# EAGLE schematic boardv3 (EAGLE 9.1.0)

## Sheet 1 of 2
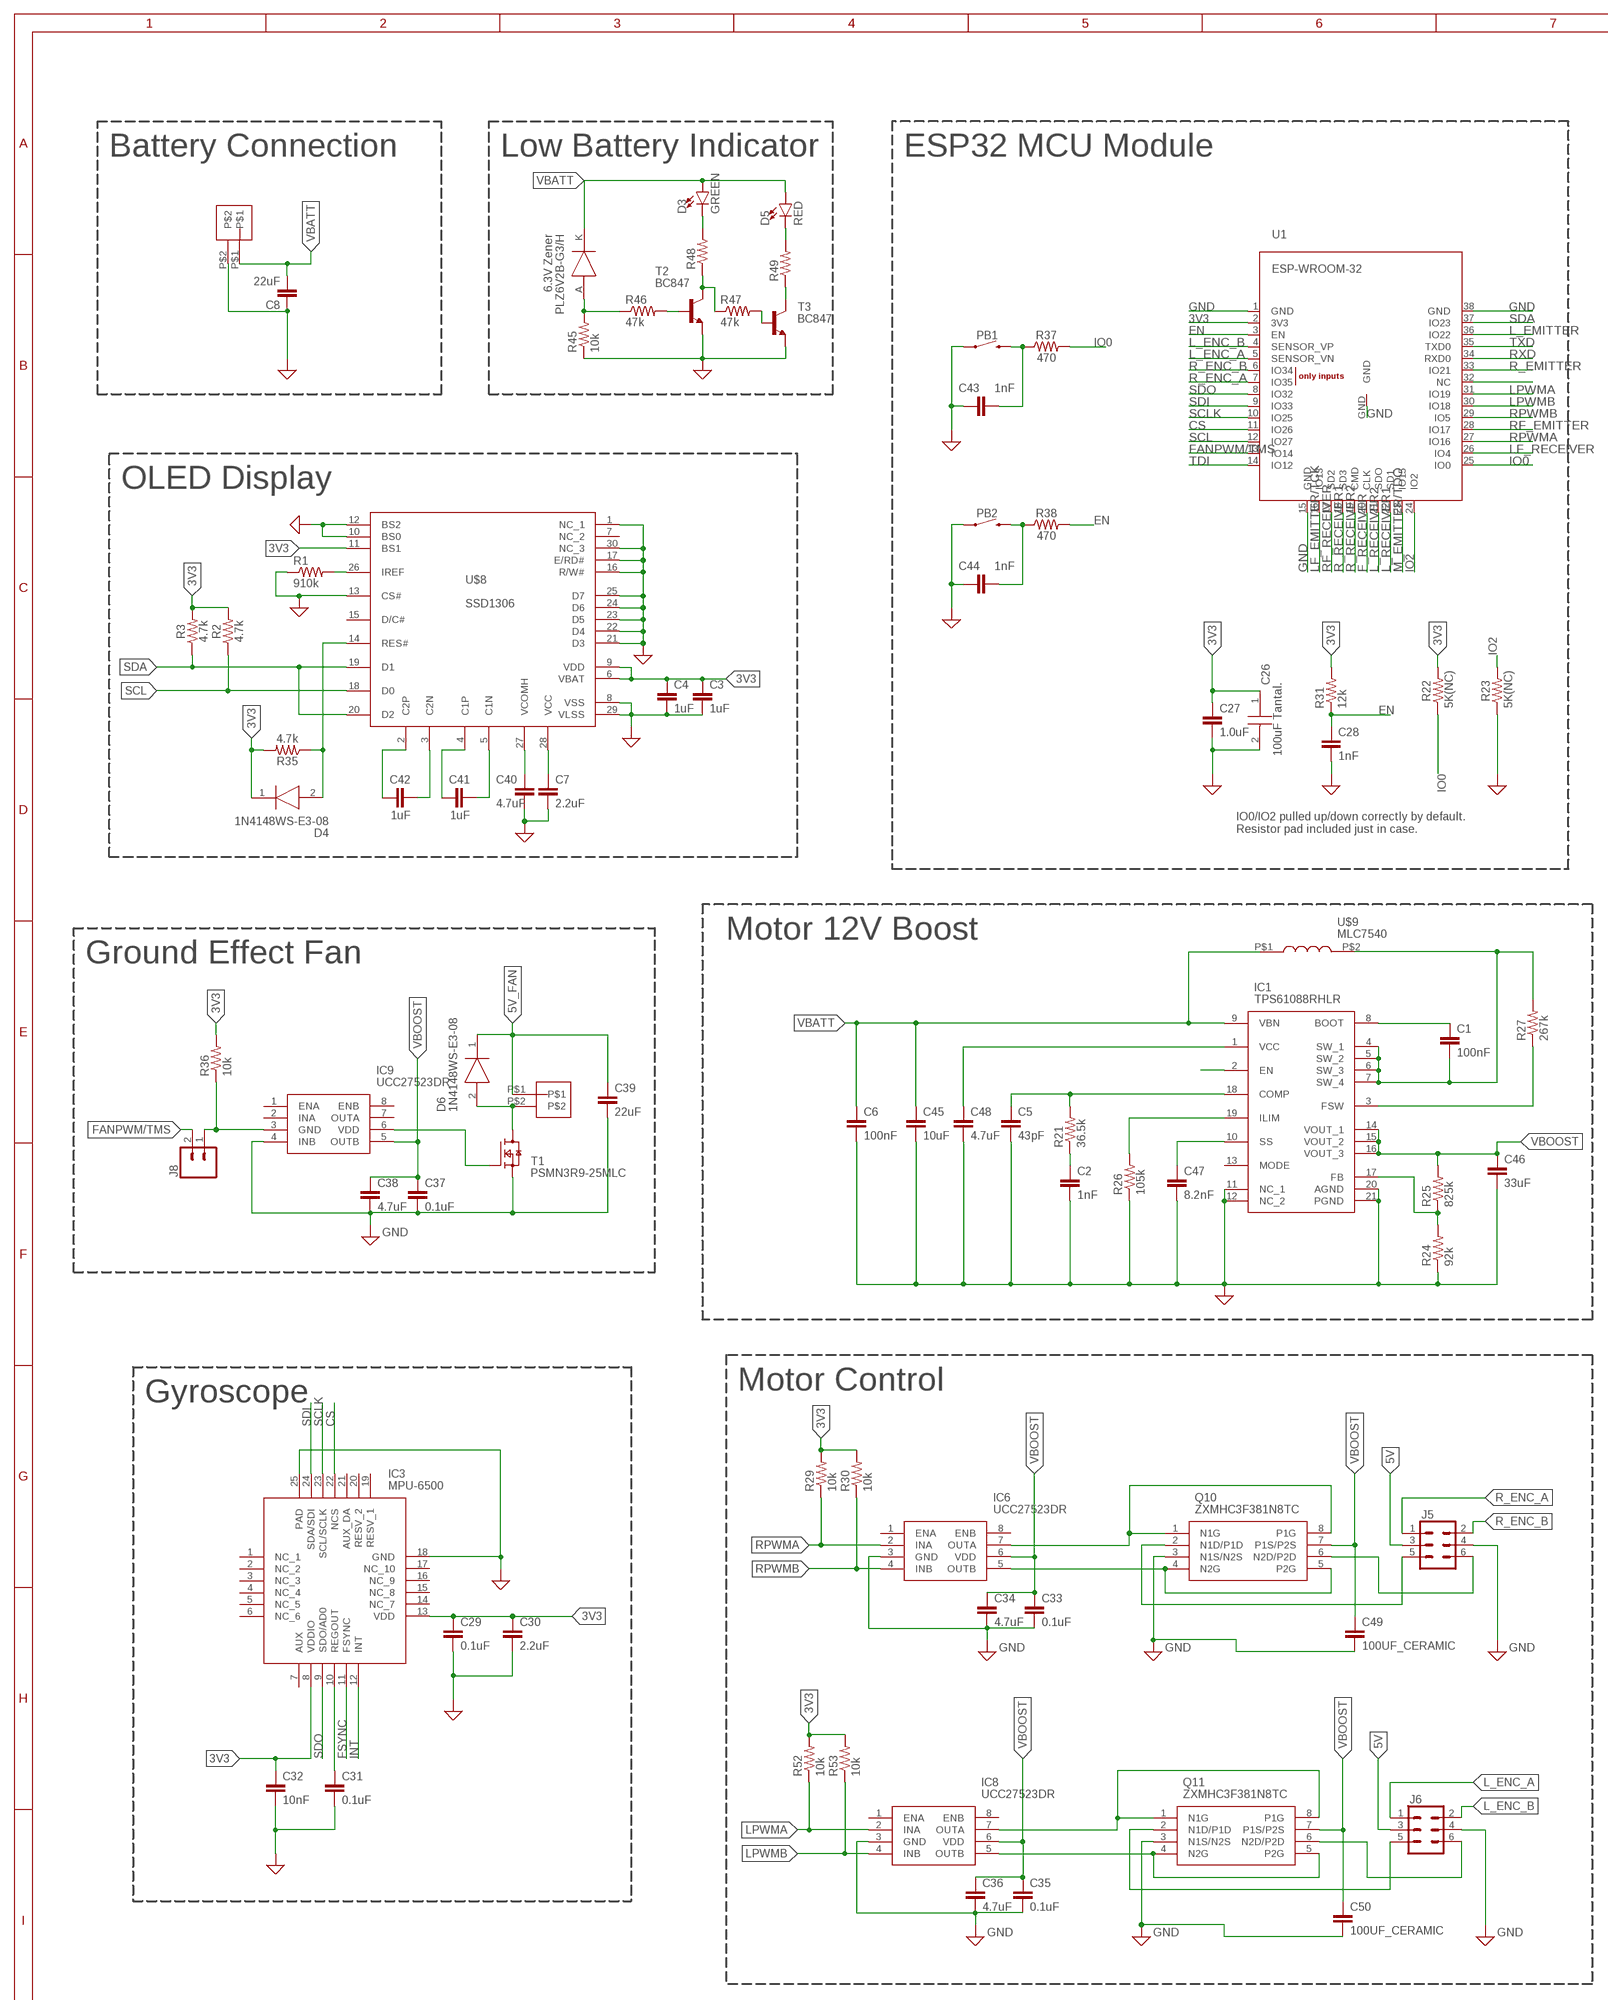
[diagram p0: schematic, sheet 1, part 1 of 2]
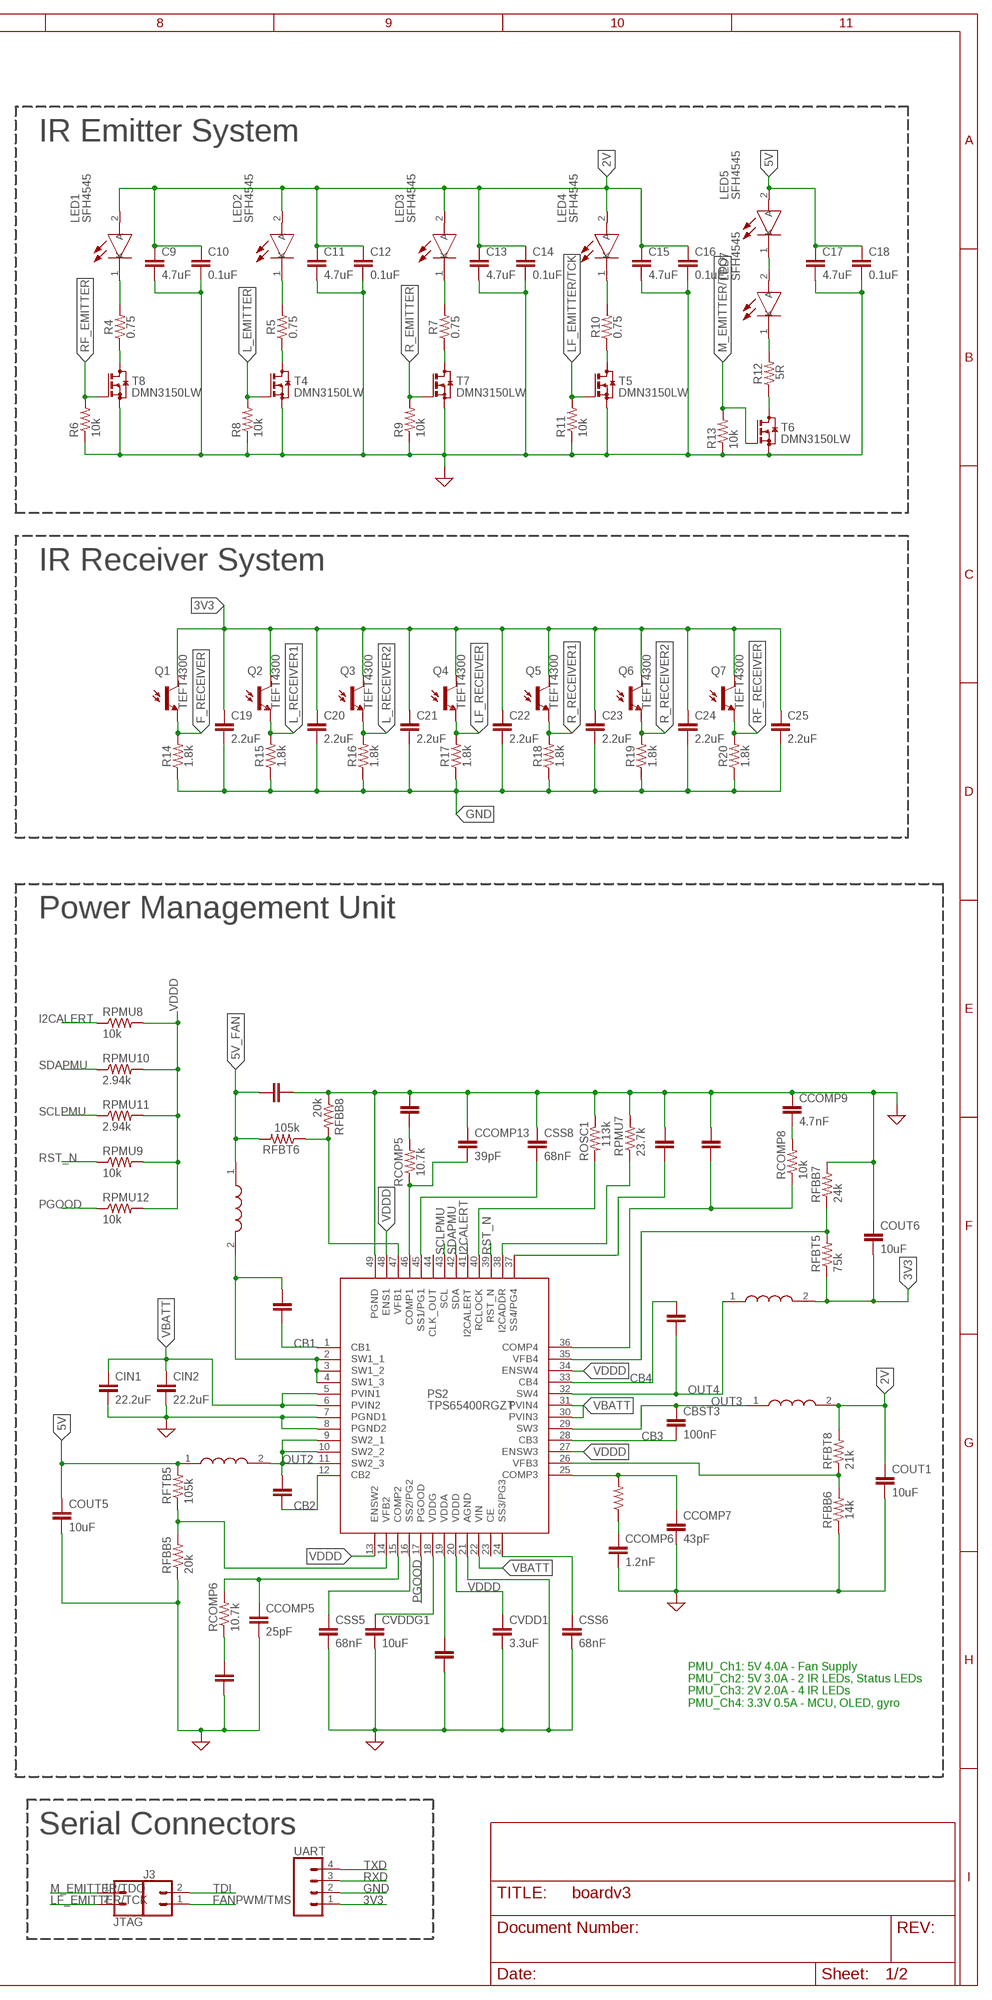
[diagram p1: schematic, sheet 1, part 2 of 2]

### Parts
C1  100nF  C-EUC0402  [C0402]
C2  1nF  C-EUC0805  [C0805]
C3  1uF  C-EUC0402  [C0402]
C4  1uF  C-EUC0402  [C0402]
C5  43pF  C-EUC0402  [C0402]
C6  100nF  C-EUC0805  [C0805]
C7  2.2uF  C-EUC0402  [C0402]
C8  22uF  22UF-0805-6.3V-20%  [0805]
C9  4.7uF  4.7UF0603  [0603]
C10  0.1uF  C-EUC0402  [C0402]
C11  4.7uF  4.7UF0603  [0603]
C12  0.1uF  C-EUC0402  [C0402]
C13  4.7uF  4.7UF0603  [0603]
C14  0.1uF  C-EUC0402  [C0402]
C15  4.7uF  4.7UF0603  [0603]
C16  0.1uF  C-EUC0402  [C0402]
C17  4.7uF  4.7UF0603  [0603]
C18  0.1uF  C-EUC0402  [C0402]
C19  2.2uF  2.2UF-0603-10V-20%  [0603]
C20  2.2uF  2.2UF-0603-10V-20%  [0603]
C21  2.2uF  2.2UF-0603-10V-20%  [0603]
C22  2.2uF  2.2UF-0603-10V-20%  [0603]
C23  2.2uF  2.2UF-0603-10V-20%  [0603]
C24  2.2uF  2.2UF-0603-10V-20%  [0603]
C25  2.2uF  2.2UF-0603-10V-20%  [0603]
C26  100uF Tantal.  TPSB107K006R0400  [CAPPM3528X210N]
C27  1.0uF  1.0UF-0402-16V-10%  [0402]
C28  1nF  1.0NF/1000PF-0603-50V-10%  [0603]
C29  0.1uF  0.1UF-0603-25V-(+80/-20%)  [0603]
C30  2.2uF  2.2UF-0603-10V-20%  [0603]
C31  0.1uF  0.1UF-0603-25V-(+80/-20%)  [0603]
C32  10nF  10NF-0603-50V-10%  [0603]
C33  0.1uF  0.1UF-0603-25V-(+80/-20%)  [0603]
C34  4.7uF  4.7UF0603  [0603]
C35  0.1uF  0.1UF-0603-25V-(+80/-20%)  [0603]
C36  4.7uF  4.7UF0603  [0603]
C37  0.1uF  0.1UF-0603-25V-(+80/-20%)  [0603]
C38  4.7uF  4.7UF0603  [0603]
C39  22uF  22UF-0805-6.3V-20%  [0805]
C40  4.7uF  C-EUC0402  [C0402]
C41  1uF  C-EUC0402  [C0402]
C42  1uF  C-EUC0402  [C0402]
C43  1nF  1.0NF/1000PF-0603-50V-10%  [0603]
C44  1nF  1.0NF/1000PF-0603-50V-10%  [0603]
C45  10uF  C-EUC0402  [C0402]
C46  33uF  C-EUC1206  [C1206]
C47  8.2nF  C-EUC0805  [C0805]
C48  4.7uF  C-EUC0402  [C0402]
C49  100UF_CERAMIC  [C1210]
C50  100UF_CERAMIC  [C1210]
CBST1  100nF  C-EUC0402  [C0402]
CBST2  100nF  C-EUC0402  [C0402]
CBST3  100nF  C-EUC0402  [C0402]
CBST4  100nF  C-EUC0402  [C0402]
CCOMP5  25pF  C-EUC0603  [C0603]
CCOMP6  1.2nF  C-EUC0603  [C0603]
CCOMP7  43pF  C-EUC0603  [C0603]
CCOMP8  1.8nF  C-EUC0603  [C0603]
CCOMP9  4.7nF  C-EUC0603  [C0603]
CCOMP10  82pF  C-EUC0603  [C0603]
CCOMP11  1.2nF  C-EUC0603  [C0603]
CCOMP13  39pF  C-EUC0603  [C0603]
CIN1  22.2uF  10UF-0805-10V-10%  [0805]
CIN2  22.2uF  10UF-0805-10V-10%  [0805]
CIN3  22.2uF  10UF-0805-10V-10%  [0805]
COUT1  10uF  C-EUC0402  [C0402]
COUT5  10uF  C-EUC0402  [C0402]
COUT6  10uF  C-EUC0402  [C0402]
CSS5  68nF  C-EUC0402  [C0402]
CSS6  68nF  C-EUC0402  [C0402]
CSS7  68nF  C-EUC0402  [C0402]
CSS8  68nF  C-EUC0402  [C0402]
CVDD1  3.3uF  C-EUC0402  [C0402]
CVDDA1  4.7uF  4.7UF0603  [0603]
CVDDG1  10uF  C-EUC0603  [C0603]
D3  GREEN  LED-GREEN0603  [LED-0603]
D4  1N4148WS-E3-08  [SOD2713X115N]
D5  RED  LED-RED0603  [LED-0603]
D6  1N4148WS-E3-08  [SOD2713X115N]
IC1  TPS61088RHLR  [RHL(R-PVQFN-N20)_1]
IC3  MPU-6500  [QFN40P300X300X95-25N]
IC6  UCC27523DR  [SOIC127P600X175-8N]
IC8  UCC27523DR  [SOIC127P600X175-8N]
IC9  UCC27523DR  [SOIC127P600X175-8N]
J2  2_PIN_JST-XH  [2_PIN_JST-XH]
J3  CONN_02  [1X02]
J5  CONN_03X22X3_SILK_MALE_PTH  [2X3]
J6  CONN_03X22X3_SILK_MALE_PTH  [2X3]
J7  2_PIN_JST-XH  [2_PIN_JST-XH]
J8  CONN_02  [1X02]
JTAG  CONN_02  [1X02]
L5  XAL4030-332MEB  [XAL4030-332MEB]
L6  SDR0302-100ML  SDR0302-1R2ML  [SDR0302-471KL]
L7  XAL4030-472MEB  XAL4030-332MEB  [XAL4030-332MEB]
L8  XFL4020-472MEB  XFL4020-332MEB  [XFL4020-222ME]
LED1  SFH4545  SFH4550  [SFH_4556P]
LED2  SFH4545  SFH4550  [SFH_4556P]
LED3  SFH4545  SFH4550  [SFH_4556P]
LED4  SFH4545  SFH4550  [SFH_4556P]
LED5  SFH4545  SFH4550  [SFH_4556P]
LED7  SFH4545  SFH4550  [SFH_4556P]
PB1  SPST_3X6X2.5MMPB  [3X6X2.5MMSPB]
PB2  SPST_3X6X2.5MMPB  [3X6X2.5MMSPB]
PLZ6V2B-G3/H  6.3V Zener  PLZ6V8C-HG3/H  [DO-219AC]
PS2  TPS65400RGZT  [QFN50P700X700X100-49N]
Q1  TEFT4300  [TEFT4300]
Q2  TEFT4300  [TEFT4300]
Q3  TEFT4300  [TEFT4300]
Q4  TEFT4300  [TEFT4300]
Q5  TEFT4300  [TEFT4300]
Q6  TEFT4300  [TEFT4300]
Q7  TEFT4300  [TEFT4300]
Q10  ZXMHC3F381N8TC  [SOIC127P600X175-8N]
Q11  ZXMHC3F381N8TC  [SOIC127P600X175-8N]
R1  910k  R-US_R0402  [R0402]
R2  4.7k  4.7KOHM-0603-1/10W-1%  [0603]
R3  4.7k  4.7KOHM-0603-1/10W-1%  [0603]
R4  0.75  0.75OHM-0805-1/4W-1%  [0805]
R5  0.75  0.75OHM-0805-1/4W-1%  [0805]
R6  10k  R-US_R0201  [R0201]
R7  0.75  0.75OHM-0805-1/4W-1%  [0805]
R8  10k  R-US_R0201  [R0201]
R9  10k  R-US_R0201  [R0201]
R10  0.75  0.75OHM-0805-1/4W-1%  [0805]
R11  10k  R-US_R0201  [R0201]
R12  5R  RESISTOR0805  [0805]
R13  10k  R-US_R0201  [R0201]
R14  1.8k  1.8KOHM-0603-1/10W-1%  [0603]
R15  1.8k  1.8KOHM-0603-1/10W-1%  [0603]
R16  1.8k  1.8KOHM-0603-1/10W-1%  [0603]
R17  1.8k  1.8KOHM-0603-1/10W-1%  [0603]
R18  1.8k  1.8KOHM-0603-1/10W-1%  [0603]
R19  1.8k  1.8KOHM-0603-1/10W-1%  [0603]
R20  1.8k  1.8KOHM-0603-1/10W-1%  [0603]
R21  36.5k  R-US_R0201  [R0201]
R22  5K(NC)  RESISTOR0402  [0402]
R23  5K(NC)  RESISTOR0402  [0402]
R24  92k  R-US_R0805  [R0805]
R25  825k  R-US_R0402  [R0402]
R26  105k  R-US_R0201  [R0201]
R27  267k  R-US_R0402  [R0402]
R29  10k  R-US_R0201  [R0201]
R30  10k  R-US_R0201  [R0201]
R31  12k  R-US_R0201  [R0201]
R35  4.7k  4.7KOHM-0603-1/10W-1%  [0603]
R36  10k  R-US_R0201  [R0201]
R37  470  470OHM-0603-1/10W-1%  [0603]
R38  470  470OHM-0603-1/10W-1%  [0603]
R45  10k  R-US_R0402  [R0402]
R46  47k  R-US_R0402  [R0402]
R47  47k  R-US_R0402  [R0402]
R48  R-US_R0603  [R0603]
R49  R-US_R0603  [R0603]
R52  10k  R-US_R0201  [R0201]
R53  10k  R-US_R0201  [R0201]
RCOMP5  10.7k  RESISTOR0402  [0402]
RCOMP6  10.7k  R-US_R0402  [R0402]
RCOMP7  9.31k  R-US_R0402  [R0402]
RCOMP8  10k  R-US_R0201  [R0201]
RFBB5  20k  R-US_R0805  [R0805]
RFBB6  14k  RESISTOR0402  [0402]
RFBB7  24k  R-US_R0805  [R0805]
RFBB8  20k  R-US_R0805  [R0805]
RFBT5  75k  R-US_R0402  [R0402]
RFBT6  105k  R-US_R0201  [R0201]
RFBT8  21k  R-US_R0402  [R0402]
RFTB5  105k  R-US_R0201  [R0201]
ROSC1  113k  R-US_R0402  [R0402]
RPMU7  23.7k  R-US_R0201  [R0201]
RPMU8  10k  R-US_R0201  [R0201]
RPMU9  10k  R-US_R0201  [R0201]
RPMU10  2.94k  R-US_R0402  [R0402]
RPMU11  2.94k  R-US_R0402  [R0402]
RPMU12  10k  R-US_R0201  [R0201]
T1  PSMN3R9-25MLC  [SOT1210]
T2  BC847  [SOT23]
T3  BC847  [SOT23]
T4  DMN3150LW  [SOT323]
T5  DMN3150LW  [SOT323]
T6  DMN3150LW  [SOT323]
T7  DMN3150LW  [SOT323]
T8  DMN3150LW  [SOT323]
U1  ESP-WROOM-32  [ESP-WROOM-32]
U$8  SSD1306  [30PINFPC_P0.7MM]
U$9  MLC7540  [MLC7540]
UART  CONN_04  [1X04]

### Nets
2V: C9.1 C10.1 C11.1 C12.1 C13.1 C14.1 C15.1 C16.1 COUT1.1 L8.2 LED1.2(A) LED2.2(A) LED3.2(A) LED4.2(A) RFBT8.2
3V3: C3.1 C4.1 C19.1 C20.1 C21.1 C22.1 C23.1 C24.1 C25.1 C26.1 C27.1 C29.1 C30.1 C32.1 COUT6.2 D4.1(K) IC3.8(VDDIO) IC3.13(VDD) L6.2 Q1.1(C) Q2.1(C) Q3.1(C) Q4.1(C) Q5.1(C) Q6.1(C) Q7.1(C) R2.2 R3.2 R22.2 R29.2 R30.2 R31.2 R35.2 R36.2 R52.2 R53.2 RFBT5.1 U1.2(3V3) U$8.6(VBAT) U$8.9(VDD) U$8.11(BS1) UART.1
5V: C17.1 C18.1 COUT5.1 J5.3 J6.3 L5.1 LED5.2(A) RFTB5.2
5V_FAN: C39.1 CIN3.1 D6.1(K) J7.P$1 L7.1 RFBT6.2
BOOSTEN: IC1.2(EN)
CB1: CBST1.1 PS2.1(CB1)
CB2: CBST2.1 PS2.12(CB2)
CB3: CBST3.2 PS2.28(CB3)
CB4: CBST4.2 PS2.33(CB4)
COMP1: CCOMP13.2 PS2.46(COMP1) RCOMP5.1
COMP2: CCOMP5.1 PS2.15(COMP2) RCOMP6.2
COMP3: CCOMP7.1 PS2.25(COMP3) RCOMP7.2
COMP4: CCOMP10.1 PS2.36(COMP4) RCOMP8.1
CS: IC3.22(NCS) U1.11(IO26)
EN: C28.1 R31.1 R38.2 U1.3(EN)
F_RECEIVER: Q1.2(E) R14.2 U1.20(CLK)
FANPWM: IC9.3(GND) J8.1 R36.1
FANPWM/TMS: J3.1 J8.2 U1.13(IO14)
FSYNC: IC3.11(FSYNC)
GND: C2.2 C3.2 C4.2 C5.2 C6.2 C7.2 C8.1 C9.2 C10.2 C11.2 C12.2 C13.2 C14.2 C15.2 C16.2 C17.2 C18.2 C19.2 C20.2 C21.2 C22.2 C23.2 C24.2 C25.2 C26.2 C27.2 C28.2 C29.2 C30.2 C31.2 C32.2 C33.2 C34.2 C35.2 C36.2 C37.2 C38.2 C39.2 C40.2 C43.1 C44.1 C45.2 C46.2 C47.2 C48.2 C49.2 C50.2 CCOMP5.2 CCOMP6.2 CCOMP7.2 CCOMP8.1 CCOMP9.1 CCOMP10.2 CCOMP11.1 CCOMP13.1 CIN1.2 CIN2.2 CIN3.2 COUT1.2 COUT5.2 COUT6.1 CSS5.2 CSS6.2 CSS7.2 CSS8.1 CVDD1.2 CVDDA1.1 CVDDG1.2 IC1.11(NC_1) IC1.12(NC_2) IC1.20(AGND) IC1.21(PGND) IC3.18(GND) IC3.25(PAD) IC6.3(GND) IC8.3(GND) IC9.4(INB) J2.P$2 J5.4 J6.4 PB1.1 PB2.1 PS2.7(PGND1) PS2.8(PGND2) PS2.21(AGND) PS2.49(PGND) Q10.3(N1S/N2S) Q11.3(N1S/N2S) R1.1 R6.1 R8.1 R9.1 R11.1 R13.1 R14.1 R15.1 R16.1 R17.1 R18.1 R19.1 R20.1 R23.1 R24.1 R26.1 R45.1 RFBB5.1 RFBB6.1 RFBB7.2 RFBB8.1 ROSC1.1 RPMU7.2 T1.1(S) T1.2(S) T1.3(S) T2.2(E) T3.2(E) T4.S T5.S T6.S T7.S T8.S U1.1(GND) U1.15(GND) U1.38(GND) U1.GND U$8.1(NC_1) U$8.8(VSS) U$8.10(BS0) U$8.12(BS2) U$8.13(CS#) U$8.16(R/W#) U$8.17(E/RD#) U$8.21(D3) U$8.22(D4) U$8.23(D5) U$8.24(D6) U$8.25(D7) U$8.29(VLSS) U$8.30(NC_3) UART.2 ; supply symbol labelled SUP
I2CADDR: PS2.38(I2CADDR) RPMU7.1
I2CALERT: PS2.41(I2CALERT) RPMU8.1
INT: IC3.12(INT)
IO0: R22.1 R37.2 U1.25(IO0)
IO2: R23.2 U1.24(IO2)
L_EMITTER: R8.2 T4.G U1.36(IO22)
L_ENC_A: J6.1 U1.5(SENSOR_VN)
L_ENC_B: J6.2 U1.4(SENSOR_VP)
L_RECEIVER1: Q2.2(E) R15.2 U1.22(SD1)
L_RECEIVER2: Q3.2(E) R16.2 U1.21(SDO)
LF_EMITTER/TCK: JTAG.2 R11.2 T5.G U1.16(IO13)
LF_RECEIVER: Q4.2(E) R17.2 U1.26(IO4)
LPWMA: IC8.2(INA) R52.1 U1.31(IO19)
LPWMB: IC8.4(INB) R53.1 U1.30(IO18)
M_EMITTER/TDO: JTAG.1 R13.2 T6.G U1.23(IO15)
N1D: J5.5 Q10.2(N1D/P1D)
N1D_2: J6.5 Q11.2(N1D/P1D)
N1G: IC6.7(OUTA) Q10.1(N1G) Q10.8(P1G)
N1G_2: IC8.7(OUTA) Q11.1(N1G) Q11.8(P1G)
N2D: J5.6 Q10.6(N2D/P2D)
N2D_2: J6.6 Q11.6(N2D/P2D)
N2G: IC6.5(OUTB) Q10.4(N2G) Q10.5(P2G)
N2G_2: IC8.5(OUTB) Q11.4(N2G) Q11.5(P2G)
N$1: C5.1 IC1.18(COMP) R21.2
N$2: C1.1 IC1.8(BOOT)
N$3: C1.2 IC1.4(SW_1) IC1.5(SW_2) IC1.6(SW_3) IC1.7(SW_4) R27.2 U$9.P$2
N$4: C48.1 IC1.1(VCC)
N$6: C47.1 IC1.10(SS)
N$12: R46.2 T2.1(B)
N$13: LED5.1(K) LED7.2(A)
N$14: IC1.19(ILIM) R26.2
N$15: C2.1 R21.1
N$16: LED1.1(K) R4.2
N$17: R4.1 T8.D
N$20: LED7.1(K) R12.2
N$21: LED2.1(K) R5.2
N$22: R5.1 T4.D
N$23: R12.1 T6.D
N$24: C43.2 PB1.2 R37.1
N$26: LED3.1(K) R7.2
N$27: R7.1 T7.D
N$28: IC9.6(VDD) T1.4(G)
N$29: IC1.17(FB) R24.2 R25.1
N$30: D6.2(A) J7.P$2 T1.MB(D)
N$31: LED4.1(K) R10.2
N$32: R10.1 T5.D
N$34: IC1.3(FSW) R27.1
N$37: C44.2 PB2.2 R38.1
N$45: PLZ6V2B-G3/H.A R45.2 R46.1
N$46: R47.1 R48.1 T2.3(C)
N$47: R47.2 T3.1(B)
N$48: D3.C R48.2
N$49: C42.1 U$8.2(C2P)
N$50: D5.C R49.2
N$51: R49.1 T3.3(C)
N$56: C42.2 U$8.3(C2N)
N$57: C41.1 U$8.4(C1P)
N$58: C41.2 U$8.5(C1N)
N$59: C40.1 U$8.27(VCOMH)
N$60: C7.1 U$8.28(VCC)
N$61: D4.2(A) R35.1 U$8.14(RES#)
N$63: R1.2 U$8.26(IREF)
N$68: CCOMP6.1 RCOMP7.1
N$74: CCOMP8.2 RCOMP6.1
N$80: CCOMP9.2 RCOMP8.2
N$85: CCOMP11.2 RCOMP5.2
NC: U1.32(NC)
OUT1: CBST1.2 L7.2 PS2.2(SW1_1) PS2.3(SW1_2) PS2.4(SW1_3)
OUT2: CBST2.2 L5.2 PS2.9(SW2_1) PS2.10(SW2_2) PS2.11(SW2_3)
OUT3: CBST3.1 L8.1 PS2.29(SW3)
OUT4: CBST4.1 L6.1 PS2.32(SW4)
PGOOD: PS2.17(PGOOD) RPMU12.1
R_EMITTER: R9.2 T7.G U1.33(IO21)
R_ENC_A: J5.1 U1.7(IO35)
R_ENC_B: J5.2 U1.6(IO34)
R_RECEIVER1: Q5.2(E) R18.2 U1.18(SD3)
R_RECEIVER2: Q6.2(E) R19.2 U1.19(CMD)
RCLOCK: PS2.40(RCLOCK) ROSC1.2
REGOUT: C31.1 IC3.10(REGOUT)
RF_EMITTER: R6.2 T8.G U1.28(IO17)
RF_RECEIVER: Q7.2(E) R20.2 U1.17(SD2)
RPWMA: IC6.2(INA) R29.1 U1.27(IO16)
RPWMB: IC6.4(INB) R30.1 U1.29(IO5)
RST_N: PS2.39(RST_N) RPMU9.1
RXD: U1.34(RXD0) UART.3
SCL: R2.1 U1.12(IO27) U$8.18(D0)
SCLK: IC3.23(SCL/SCLK) U1.10(IO25)
SCLPMU: PS2.43(SCL) RPMU11.1
SDA: R3.1 U1.37(IO23) U$8.19(D1) U$8.20(D2)
SDAPMU: PS2.42(SDA) RPMU10.1
SDI: IC3.24(SDA/SDI) U1.9(IO33)
SDO: IC3.9(SDO/AD0) U1.8(IO32)
SS1: CSS8.2 PS2.45(SS1/PG1)
SS2: CSS5.1 PS2.16(SS2/PG2)
SS3: CSS6.1 PS2.24(SS3/PG3)
SS4: CSS7.1 PS2.37(SS4/PG4)
TDI: J3.2 U1.14(IO12)
TXD: U1.35(TXD0) UART.4
VBATT: C6.1 C8.2 C45.1 CIN1.1 CIN2.1 D3.A D5.A IC1.9(VBN) J2.P$1 PLZ6V2B-G3/H.K PS2.5(PVIN1) PS2.6(PVIN2) PS2.22(VIN) PS2.30(PVIN3) PS2.31(PVIN4) U$9.P$1
VBOOST: C33.1 C34.1 C35.1 C36.1 C37.1 C38.1 C46.1 C49.1 C50.1 IC1.14(VOUT_1) IC1.15(VOUT_2) IC1.16(VOUT_3) IC6.6(VDD) IC8.6(VDD) IC9.5(OUTB) Q10.7(P1S/P2S) Q11.7(P1S/P2S) R25.2
VDDA: CVDDA1.2 PS2.19(VDDA)
VDDD: CVDD1.1 PS2.13(ENSW2) PS2.20(VDDD) PS2.27(ENSW3) PS2.34(ENSW4) PS2.48(ENS1) RPMU8.2 RPMU9.2 RPMU10.2 RPMU11.2 RPMU12.2
VDDG: CVDDG1.1 PS2.18(VDDG)
VFB1: PS2.47(VFB1) RFBB8.2 RFBT6.1
VFB2: PS2.14(VFB2) RFBB5.2 RFTB5.1
VFB3: PS2.26(VFB3) RFBB6.2 RFBT8.1
VFB4: PS2.35(VFB4) RFBB7.1 RFBT5.2
Unconnected: IC1.13(MODE) IC3.1(NC_1) IC3.2(NC_2) IC3.3(NC_3) IC3.4(NC_4) IC3.5(NC_5) IC3.6(NC_6) IC3.7(AUX) IC3.14(NC_7) IC3.15(NC_8) IC3.16(NC_9) IC3.17(NC_10) IC3.19(RESV_1) IC3.20(RESV_2) IC3.21(AUX_DA) IC6.1(ENA) IC6.8(ENB) IC8.1(ENA) IC8.8(ENB) IC9.1(ENA) IC9.2(INA) IC9.7(OUTA) IC9.8(ENB) PS2.23(CE) PS2.44(CLK_OUT) U$8.7(NC_2) U$8.15(D/C#)

### Notes on the sheet
- IR Emitter System
- Battery Connection | Low Battery Indicator | ESP32 MCU Module
- OLED Display
- IR Receiver System
- IO0/IO2 pulled up/down correctly by default. 
  Resistor pad included just in case.
- Motor 12V Boost | Power Management Unit
- Ground Effect Fan
- Motor Control
- Gyroscope
- PMU_Ch1: 5V 4.0A - Fan Supply
  PMU_Ch2: 5V 3.0A - 2 IR LEDs, Status LEDs
  PMU_Ch3: 2V 2.0A - 4 IR LEDs
  PMU_Ch4: 3.3V 0.5A - MCU, OLED, gyro
- Serial Connectors

## Sheet 2 of 2
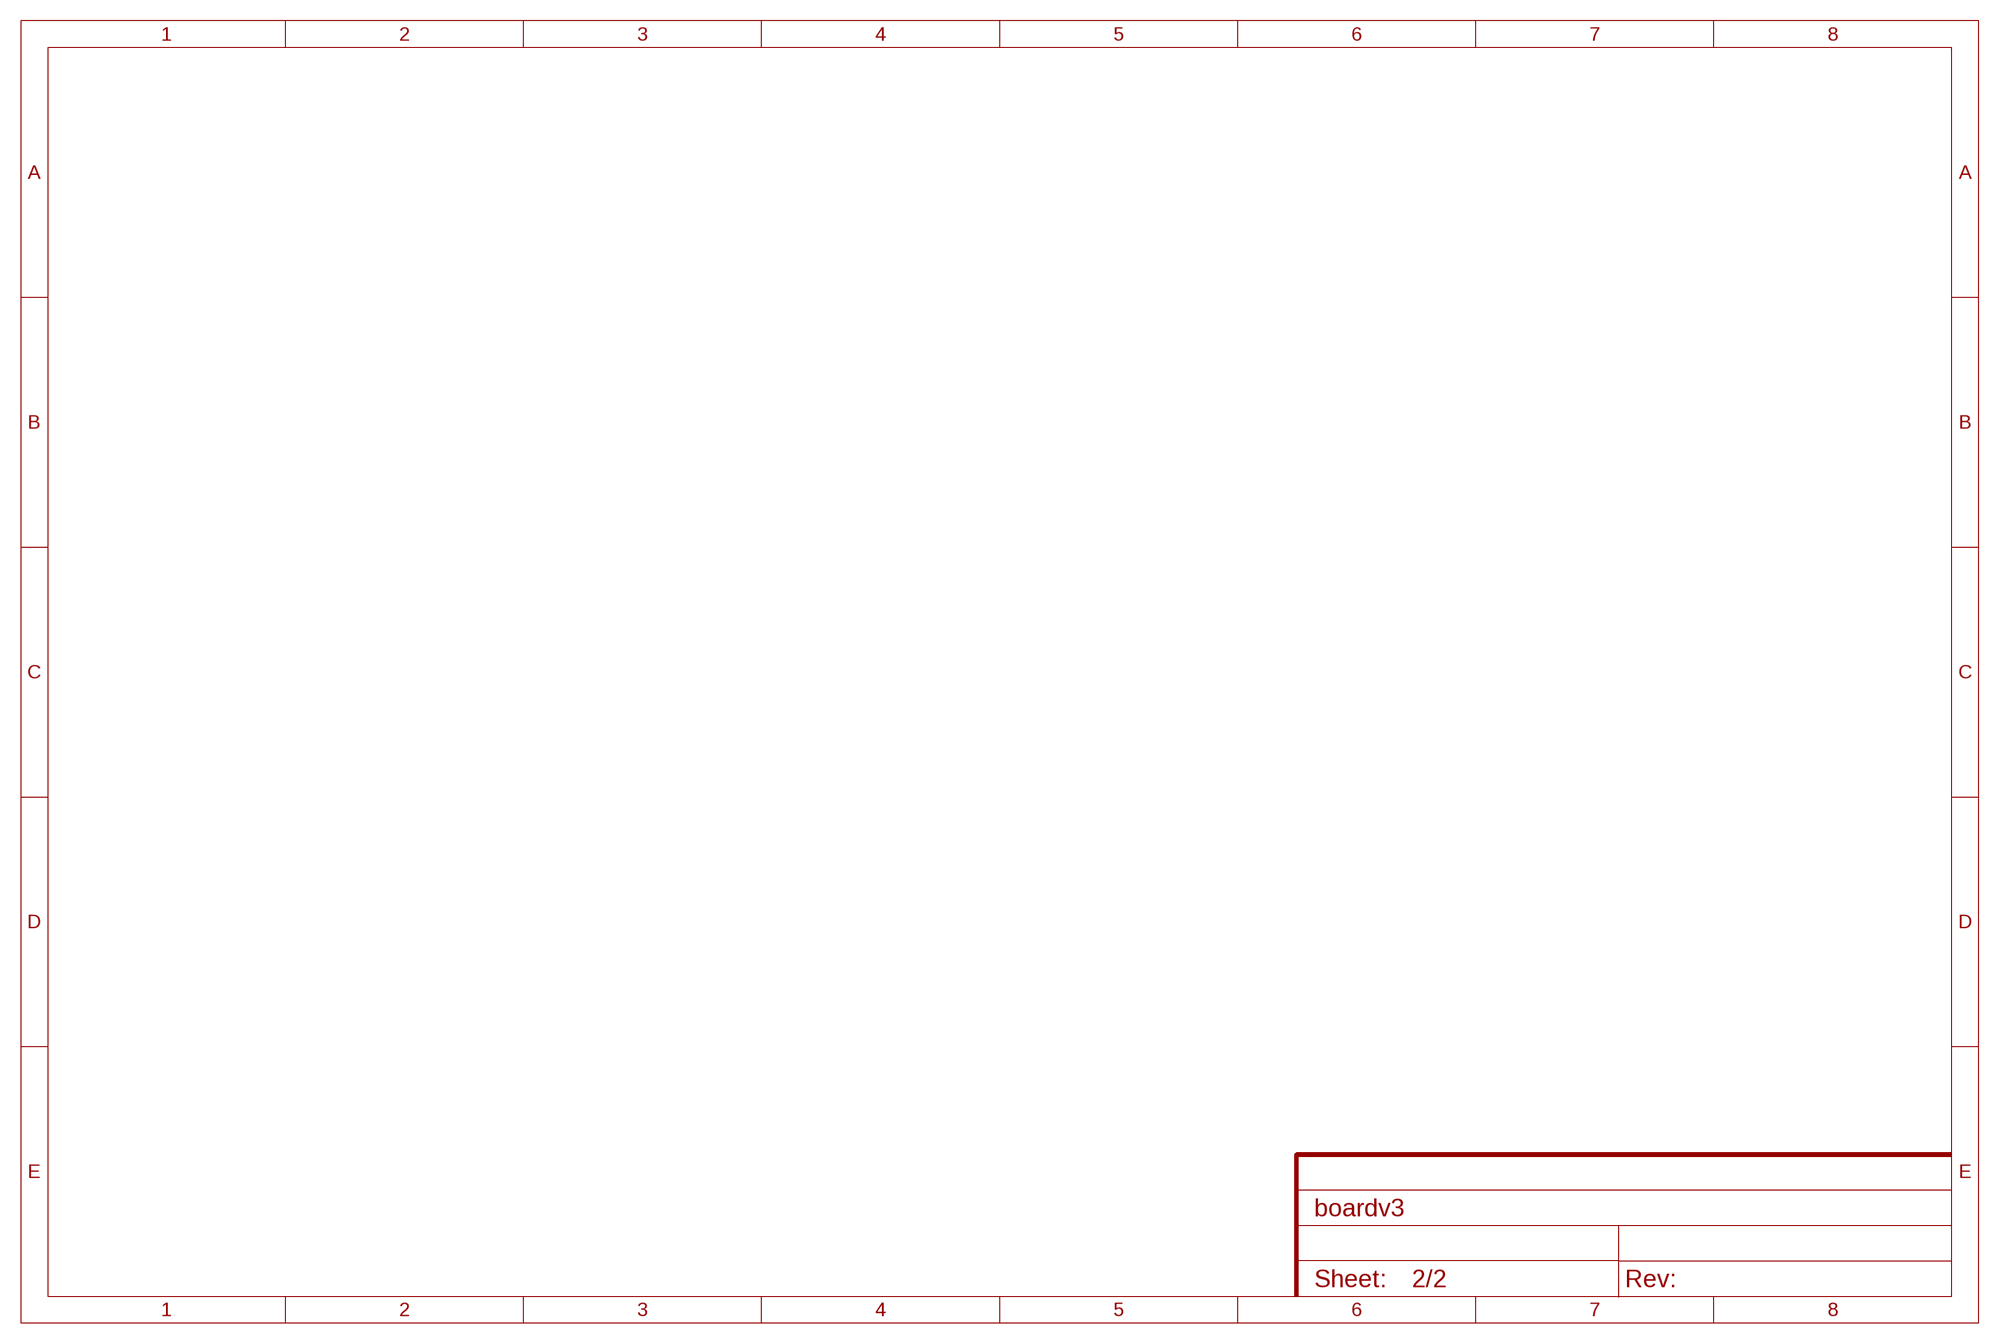
[diagram p2: schematic, sheet 2]

## Library data of the parts
C1 C2 C5 C6 C10 C12 C14 C16 C18 C45-C48 CCOMP5 CCOMP6 CCOMP9 CCOMP10 = rcl:C-EU: CAPACITOR, European symbol; SPICEPREFIX: C
C3 C4 C7 C40-C42 CBST1-CBST4 CCOMP7 CCOMP8 CCOMP11 CCOMP13 COUT1 COUT5 COUT6 CSS5-CSS8 CVDD1 CVDDG1 = resistor:C-EU: CAPACITOR, European symbol
C8 C39 = SparkFun-Capacitors:22UF: 22µF ceramic capacitors A capacitor is a passive two-terminal electrical component used to store electrical energy temporarily in an electric field.; PROD_ID: CAP-08402
C9 C11 C13 C15 C17 C34 C36 C38 CVDDA1 = SparkFun-Capacitors:4.7UF: 4.7µF ceramic capacitors A capacitor is a passive two-terminal electrical component used to store electrical energy temporarily in an electric field.; PROD_ID: CAP-08280
C19-C25 C30 = SparkFun-Capacitors:2.2UF: 2.2µF ceramic capacitors A capacitor is a passive two-terminal electrical component used to store electrical energy temporarily in an electric field.; PROD_ID: CAP-07888
C26 = micromousev2Parts:TPSB107K006R0400: AVX 100 Source: Datasheet <http://datasheets.avx.com/TPS.pdf>; ALLIED_NUMBER: 70002399; ALLIED_PRICE/STOCK: http://www.alliedelec.com/avx-tpsb107k006r0400/70002399/; ARROW_PART_NUMBER: TPSB107K006R0400; ARROW_PRICE/STOCK: https://www.arrow.com/en/products/tpsb107k006r0400/avx; DESCRIPTION: AVX 100; HEIGHT: 2.1mm; MANUFACTURER_NAME: AVX; MANUFACTURER_PART_NUMBER: TPSB107K006R0400; RS_PART_NUMBER: 1243324; RS_PRICE/STOCK: http://uk.rs-online.com/web/p/products/1243324
C27 = SparkFun-Capacitors:1.0UF: 1µF ceramic capacitors A capacitor is a passive two-terminal electrical component used to store electrical energy temporarily in an electric field.; PROD_ID: CAP-12417
C28 C43 C44 = SparkFun-Capacitors:1.0NF/1000PF: 1nF/1,000pF ceramic capacitors A capacitor is a passive two-terminal electrical component used to store electrical energy temporarily in an electric field.; PROD_ID: CAP-07886
C29 C31 C33 C35 C37 = SparkFun-Capacitors:0.1UF: 0.1µF ceramic capacitors A capacitor is a passive two-terminal electrical component used to store electrical energy temporarily in an electric field.; PROD_ID: CAP-00810
C32 = SparkFun-Capacitors:10NF: 0.01uF/10nF/10,000pF ceramic capacitors A capacitor is a passive two-terminal electrical component used to store electrical energy temporarily in an electric field. CAP-09321; PROD_ID: CAP-00867
C49 C50 = micromousev2Parts:100UF_CERAMIC
CIN1-CIN3 = SparkFun-Capacitors:10UF: 10.0µF ceramic capacitors A capacitor is a passive two-terminal electrical component used to store electrical energy temporarily in an electric field.; PROD_ID: CAP-11330; VALUE: 10uF
D3 = SparkFun-LED:LED-GREEN: Green SMD LED Used in manufacturing of various products at SparkFun Packages: 0603 - SMD 0603 package [Product Link] <http://www.futureelectronics.com/en/technologies/semiconductors/optoelectronics/leds/Pages/9894312-LTST-C190GKT.aspx?CrossPart=HSMG-C190&IM=0> LilyPad 1206 - SMD1206 LilyPad package [Product Link] <http://www.futureelectronics.com/en/Technologies/Product.aspx?ProductID=IN150NGHARVATEKCORPORATION2049943&IM=0> 1206 - SMD1206 package [Product Link] <http://www.futureelectronics.com/en/technologies/semiconductors/optoelectronics/leds/Pages/8315665-LTST-C150KGKT.aspx?IM=0> 1206 Bottom Mount -SMD 1206 Bottom Mount [Product Link] <http://www.digikey.com/product-detail/en/lite-on-inc/LTST-C230KGKT/160-1456-1-ND/386854> SparkFun Products: Pro Mini 328 -5V <https://www.sparkfun.com/products/821> RedBoard <https://www.sparkfun.com/products/12757> MP3 Trigger <https://www.sparkfun.com/products/13720> Makey Makey <https://www.sparkfun.com/products/11076>; PROD_ID: DIO-00821
D4 D6 = micromousev2Parts:1N4148WS-E3-08: Diode Switching 100V 0.15A SOD323 Vishay 1N4148WS-E3-08 Switching Diode, 150mA 75V, 2-Pin SOD-323 Source: Datasheet <http://docs-europe.electrocomponents.com/webdocs/0de2/0900766b80de295e.pdf>; ALLIED_NUMBER: 70427735; ALLIED_PRICE/STOCK: https://www.alliedelec.com/vishay-small-signal-opto-products-ssp-1n4148ws-e3-08/70427735/; ARROW_PART_NUMBER: 1N4148WS-E3-08; ARROW_PRICE/STOCK: https://www.arrow.com/en/products/1n4148ws-e3-08/vishay; DESCRIPTION: Diode Switching 100V 0.15A SOD323 Vishay 1N4148WS-E3-08 Switching Diode, 150mA 75V, 2-Pin SOD-323; HEIGHT: 1.15mm; MANUFACTURER_NAME: Vishay; MANUFACTURER_PART_NUMBER: 1N4148WS-E3-08; RS_PART_NUMBER: 7003677P; RS_PRICE/STOCK: http://uk.rs-online.com/web/p/products/7003677P
D5 = SparkFun-LED:LED-RED: Red SMD LED Used in manufacturing of most products at SparkFun Packages: 0603 - SMD 0603 package [Product Link] <http://docs.avagotech.com/docs/AV02-0551EN> 0603 SMART - SMD 0603 SMART package ( more efficient and expensive)[Product Link] <http://www.osram-os.com/Graphics/XPic2/00077099_0.pdf> 1206 - SMD1206 package [Product Link] <https://www.sparkfun.com/datasheets/DevTools/LilyPad/Q150OVS4.pdff> SparkFun Products: Pro Mini 328 -5V <https://www.sparkfun.com/products/821> RedBoard <https://www.sparkfun.com/products/12757> IOIO-OTG <https://www.sparkfun.com/products/13613>; PROD_ID: DIO-00819
IC1 = micromousev2Parts:TPS61088RHLR: 10-A Fully-Integrated Synchronous Boost Converter Source: Datasheet <http://www.ti.com/lit/gpn/tps61088>; ARROW_PART_NUMBER: TPS61088RHLR; ARROW_PRICE/STOCK: https://www.arrow.com/en/products/tps61088rhlr/texas-instruments; DESCRIPTION: 10-A Fully-Integrated Synchronous Boost Converter; HEIGHT: mm; MANUFACTURER_NAME: Texas Instruments; MANUFACTURER_PART_NUMBER: TPS61088RHLR
IC3 = micromousev2Parts:MPU-6500: 6-axis MotionTracking device, 512-byte FIFO, QFN - 3x3x0.9mm package Source: Datasheet <https://www.invensense.com/wp-content/uploads/2015/02/MPU-6500-Datasheet2.pdf>; ARROW_PART_NUMBER: MPU-6500; DESCRIPTION: 6-axis MotionTracking device, 512-byte FIFO, QFN - 3x3x0.9mm package; HEIGHT: 0.95mm; MANUFACTURER_NAME: INVENSENSE; MANUFACTURER_PART_NUMBER: MPU-6500
IC6 IC8 IC9 = micromousev2Parts:UCC27523DR: Dual, 5A, High-Speed Low-Side Power MOSFET Driver Source: Datasheet <http://www.ti.com/lit/gpn/ucc27523>; ARROW_PART_NUMBER: UCC27523DR; ARROW_PRICE/STOCK: https://www.arrow.com/en/products/ucc27523dr/texas-instruments; DESCRIPTION: Dual, 5A, High-Speed Low-Side Power MOSFET Driver; HEIGHT: 1.75mm; MANUFACTURER_NAME: Texas Instruments; MANUFACTURER_PART_NUMBER: UCC27523DR
J2 J7 = DMF-con_JST_XH_dmf:2_PIN_JST-XH: Corrected for XH 2 pin dmf 4.10.15 Source info: http://www.jst-mfg.com/product/pdf/eng/eXH.pdf Note: pin spacing is 2.5 mm Note: pins are 0.64 mm square cross section. This means the pin diagonal is 0.905 mm. Hole diameter spec'd by jst is 0.9 mm; hole diameter used here is 1.0 mm
J3 J8 JTAG = SparkFun-Connectors:CONN_02: Multi connection point. Often used as Generic Header-pin footprint for 0.1 inch spaced/style header connections On any of the 0.1 inch spaced packages, you can populate with these: Break Away Headers - Straight <https://www.sparkfun.com/products/116> (PRT-00116) Break Away Male Headers - Right Angle <https://www.sparkfun.com/products/553> (PRT-00553) Female Headers <https://www.sparkfun.com/products/115> (PRT-00115) Break Away Headers - Machine Pin <https://www.sparkfun.com/products/117> (PRT-00117) Break Away Female Headers - Swiss Machine Pin <https://www.sparkfun.com/products/743> (PRT-00743) For SCREWTERMINALS and SPRING TERMINALS visit here: Screw Terimnals on SparkFun.com <https://www.sparkfun.com/search/results?term=Screw+Terminals> (5mm/3.5mm/2.54mm spacing) This device is also useful as a general connection point to wire up your design to another part of your project. Our various solder wires solder well into these plated through hole pads. Hook-Up Wire - Assortment (Stranded, 22 AWG) <https://www.sparkfun.com/products/11375> (PRT-11375) Hook-Up Wire - Assortment (Solid Core, 22 AWG) <https://www.sparkfun.com/products/11367> (PRT-11367) View the entire wire category on our website here <https://www.sparkfun.com/categories/141> Special notes: Molex polarized connector foot print use with: PRT-08233 with associated crimp pins and housings. 2.54_SCREWTERM for use with PRT-10571. 3.5mm Screw Terminal footprints for PRT-08084 5mm Screw Terminal footprints for use with PRT-08432
J5 J6 = SparkFun-Connectors:CONN_03X2: Multi connection point. Often used as Generic Header-pin footprint for 0.1 inch spaced/style header connections You can populate with any combo of single row headers, but if you'd like an exact match, check these: Header - 2x3 (Male, 0.1") <https://www.sparkfun.com/products/12807> (PRT-12807) Header - 2x3 (Female, 0.1") <https://www.sparkfun.com/products/13010> (PRT-13010) 2x3 Pin Shrouded Header <https://www.sparkfun.com/products/10877> (PRT-10877) On any of the 0.1 inch spaced packages, you can populate with these: Break Away Headers - Straight <https://www.sparkfun.com/products/116> (PRT-00116) Break Away Male Headers - Right Angle <https://www.sparkfun.com/products/553> (PRT-00553) Female Headers <https://www.sparkfun.com/products/115> (PRT-00115) Break Away Headers - Machine Pin <https://www.sparkfun.com/products/117> (PRT-00117) Break Away Female Headers - Swiss Machine Pin <https://www.sparkfun.com/products/743> (PRT-00743) Special note: the shrouded connector mates well with our 3x2 ribbon cables: Ribbon Crimp Connector - 6-pin (2x3, Female) <https://www.sparkfun.com/products/10651> (PRT-10651) Ribbon Cable - 6 wire (15ft) <https://www.sparkfun.com/products/10646> (PRT-10646); PROD_ID: CONN-09701
L5 L7 = micromousev2Parts:XAL4030-332MEB: Fixed Inductors XAL4030 High Current 3.3 uH 20 % 6.6 A Source: Datasheet <http://www.mouser.com/ds/2/597/xal4000-270751.pdf>; ARROW_PART_NUMBER: XAL4030-332MEB; DESCRIPTION: Fixed Inductors XAL4030 High Current 3.3 uH 20 % 6.6 A; HEIGHT: mm; MANUFACTURER_NAME: COILCRAFT; MANUFACTURER_PART_NUMBER: XAL4030-332MEB
L6 = micromousev2Parts:SDR0302-1R2ML: BOURNS - SDR0302-1R2ML - INDUCTOR, 1.2UH, 20%, 2A, SMD Source: Datasheet <https://www.bourns.com/data/global/pdfs/SDR0302.pdf>; ARROW_PART_NUMBER: SDR0302-1R2ML; ARROW_PRICE/STOCK: https://www.arrow.com/en/products/sdr0302-1r2ml/bourns; DESCRIPTION: BOURNS - SDR0302-1R2ML - INDUCTOR, 1.2UH, 20%, 2A, SMD; HEIGHT: mm; MANUFACTURER_NAME: Bourns; MANUFACTURER_PART_NUMBER: SDR0302-1R2ML
L8 = micromousev2Parts:XFL4020-332MEB: COILCRAFT - XFL4020-332MEB - INDUCTOR, PWR, 3.3UH, 5.2A,20%,33MHZ Source: Datasheet <https://www.coilcraft.com/pdfs/xfl4020.pdf>; ARROW_PART_NUMBER: XFL4020-332MEB; DESCRIPTION: COILCRAFT - XFL4020-332MEB - INDUCTOR, PWR, 3.3UH, 5.2A,20%,33MHZ; HEIGHT: mm; MANUFACTURER_NAME: COILCRAFT; MANUFACTURER_PART_NUMBER: XFL4020-332MEB
LED1-LED5 LED7 = micromousev2Parts:SFH4550: OSRAM OPTO SEMICONDUCTORS - SFH4550 - LED, IR, 5MM, 850NM Source: Datasheet <https://dammedia.osram.info/media/resource/hires/osram-dam-2496286/SFH 4550.pdf>; ARROW_PART_NUMBER: SFH4550; ARROW_PRICE/STOCK: https://www.arrow.com/en/products/sfh4550/osram-opto-semiconductors; DESCRIPTION: OSRAM OPTO SEMICONDUCTORS - SFH4550 - LED, IR, 5MM, 850NM; HEIGHT: mm; MANUFACTURER_NAME: OSRAM Opto Semiconductors; MANUFACTURER_PART_NUMBER: SFH4550
PB1 PB2 = micromousev2Parts:SPST_3X6X2.5MMPB
PLZ6V2B-G3/H = micromousev2Parts:PLZ6V8C-HG3/H
PS2 = micromousev2Parts:TPS65400RGZT: Texas Instruments TPS65400RGZT, Power Management IC Source: Datasheet <http://www.ti.com/lit/ds/symlink/tps65400.pdf>; ARROW_PART_NUMBER: TPS65400RGZT; ARROW_PRICE/STOCK: https://www.arrow.com/en/products/tps65400rgzt/texas-instruments; DESCRIPTION: Texas Instruments TPS65400RGZT, Power Management IC; HEIGHT: 1mm; MANUFACTURER_NAME: Texas Instruments; MANUFACTURER_PART_NUMBER: TPS65400RGZT; RS_PART_NUMBER: 1629904; RS_PRICE/STOCK: http://uk.rs-online.com/web/p/products/1629904
Q1-Q7 = micromousev2Parts:TEFT4300: Vishay TEFT4300 60 Infrared Phototransistor, Through-hole 3mm Package Source: Datasheet <https://componentsearchengine.com/Datasheets/2/TEFT4300.pdf>; ARROW_PART_NUMBER: TEFT4300; ARROW_PRICE/STOCK: https://www.arrow.com/en/products/teft4300/vishay; DESCRIPTION: Vishay TEFT4300 60 Infrared Phototransistor, Through-hole 3mm Package; HEIGHT: mm; MANUFACTURER_NAME: Vishay; MANUFACTURER_PART_NUMBER: TEFT4300; RS_PART_NUMBER: 7082731P; RS_PRICE/STOCK: http://uk.rs-online.com/web/p/products/7082731P
Q10 Q11 = micromousev2Parts:ZXMHC3F381N8TC: MOSFET Dual N/P-Ch 30V 4.98A/4.13A SOIC8 Diodes Inc ZXMHC3F381N8TC Quad N/P-channel MOSFET Transistor, 8-Pin SO Source: Datasheet <https://www.diodes.com/assets/Datasheets/ZXMHC3F381N8.pdf>; ALLIED_NUMBER: 70438802; ALLIED_PRICE/STOCK: https://www.alliedelec.com/diodes-inc-zxmhc3f381n8tc/70438802/; ARROW_PART_NUMBER: ZXMHC3F381N8TC; ARROW_PRICE/STOCK: https://www.arrow.com/en/products/zxmhc3f381n8tc/diodes-incorporated; DESCRIPTION: MOSFET Dual N/P-Ch 30V 4.98A/4.13A SOIC8 Diodes Inc ZXMHC3F381N8TC Quad N/P-channel MOSFET Transistor, 8-Pin SO; HEIGHT: 1.75mm; MANUFACTURER_NAME: Diodes Inc.; MANUFACTURER_PART_NUMBER: ZXMHC3F381N8TC; RS_PART_NUMBER: 7515344P; RS_PRICE/STOCK: http://uk.rs-online.com/web/p/products/7515344P
R1 R6 R8 R9 R11 R13 R21 R24-R27 R29-R31 R36 R45-R49 R52 R53 RCOMP6 RCOMP7 RFBB8 RFBT6 RFBT8 RFTB5 = rcl:R-US_: RESISTOR, American symbol; SPICEPREFIX: R
R2 R3 R35 = SparkFun-Resistors:4.7KOHM: 4.7kΩ resistor A resistor is a passive two-terminal electrical component that implements electrical resistance as a circuit element. Resistors act to reduce current flow, and, at the same time, act to lower voltage levels within circuits. - Wikipedia; PROD_ID: RES-07857
R4 R5 R7 R10 = SparkFun-Resistors:0.75OHM: 0.75Ω resistor A resistor is a passive two-terminal electrical component that implements electrical resistance as a circuit element. Resistors act to reduce current flow, and, at the same time, act to lower voltage levels within circuits. - Wikipedia; PROD_ID: RES-08474
R12 R22 R23 RCOMP5 RFBB6 = SparkFun-Resistors:RESISTOR: Generic Resistor Package
R14-R20 = SparkFun-Resistors:1.8KOHM: 1.8kΩ resistor A resistor is a passive two-terminal electrical component that implements electrical resistance as a circuit element. Resistors act to reduce current flow, and, at the same time, act to lower voltage levels within circuits. - Wikipedia; PROD_ID: RES-09119
R37 R38 = SparkFun-Resistors:470OHM: 470Ω resistor A resistor is a passive two-terminal electrical component that implements electrical resistance as a circuit element. Resistors act to reduce current flow, and, at the same time, act to lower voltage levels within circuits. - Wikipedia; PROD_ID: RES-07869
RCOMP8 RFBB5 RFBB7 RFBT5 ROSC1 RPMU7-RPMU12 = resistor:R-US_: RESISTOR, American symbol
T1 = micromousev2Parts:PSMN: N-channel logic level TrenchMOS(TM) transistor AAL Eindhoven MK; LOGIC_LEVEL: 3.9 mOhm; VOLTAGE: 25V
T2 T3 = nxp_60:BC847: 45 V, 100 mA NPN general-purpose transistors NPN general-purpose transistor AAL Eindhoven MK
T4-T8 = micromousev2Parts:DMN3150LW
U1 = micromousev2Parts:ESP-WROOM-32
U$8 = micromousev2Parts:SSD1306
U$9 = micromousev2Parts:MLC7540
UART = SparkFun-Connectors:CONN_04: Multi connection point. Often used as Generic Header-pin footprint for 0.1 inch spaced/style header connections On any of the 0.1 inch spaced packages, you can populate with these: Break Away Headers - Straight <https://www.sparkfun.com/products/116> (PRT-00116) Break Away Male Headers - Right Angle <https://www.sparkfun.com/products/553> (PRT-00553) Female Headers <https://www.sparkfun.com/products/115> (PRT-00115) Break Away Headers - Machine Pin <https://www.sparkfun.com/products/117> (PRT-00117) Break Away Female Headers - Swiss Machine Pin <https://www.sparkfun.com/products/743> (PRT-00743) For SCREWTERMINALS and SPRING TERMINALS visit here: Screw Terimnals on SparkFun.com <https://www.sparkfun.com/search/results?term=Screw+Terminals> (5mm/3.5mm/2.54mm spacing) This device is also useful as a general connection point to wire up your design to another part of your project. Our various solder wires solder well into these plated through hole pads. Hook-Up Wire - Assortment (Stranded, 22 AWG) <https://www.sparkfun.com/products/11375> (PRT-11375) Hook-Up Wire - Assortment (Solid Core, 22 AWG) <https://www.sparkfun.com/products/11367> (PRT-11367) View the entire wire category on our website here <https://www.sparkfun.com/categories/141> Special notes: Molex polarized connector foot print use with SKU : PRT-08231 with associated crimp pins and housings. 1MM SMD Version SKU: PRT-10208; PROD_ID: CONN-09696